# Altium schematic sheet DAC.SchDoc
size 279 x 215 mm; SheetNumber: 2; SheetTotal: 5; SPICEModelCacheRUGZJIPY: <root> / <DocumentId>RUGZJIPY</DocumentId> / <CacheFrame Number="0"> / <Model Name="cap" Kind="MDL"> / <Text>*Default semiconductor capacitor / .MODEL CAP C()</Text> / </Model> / </CacheFrame> / </root>
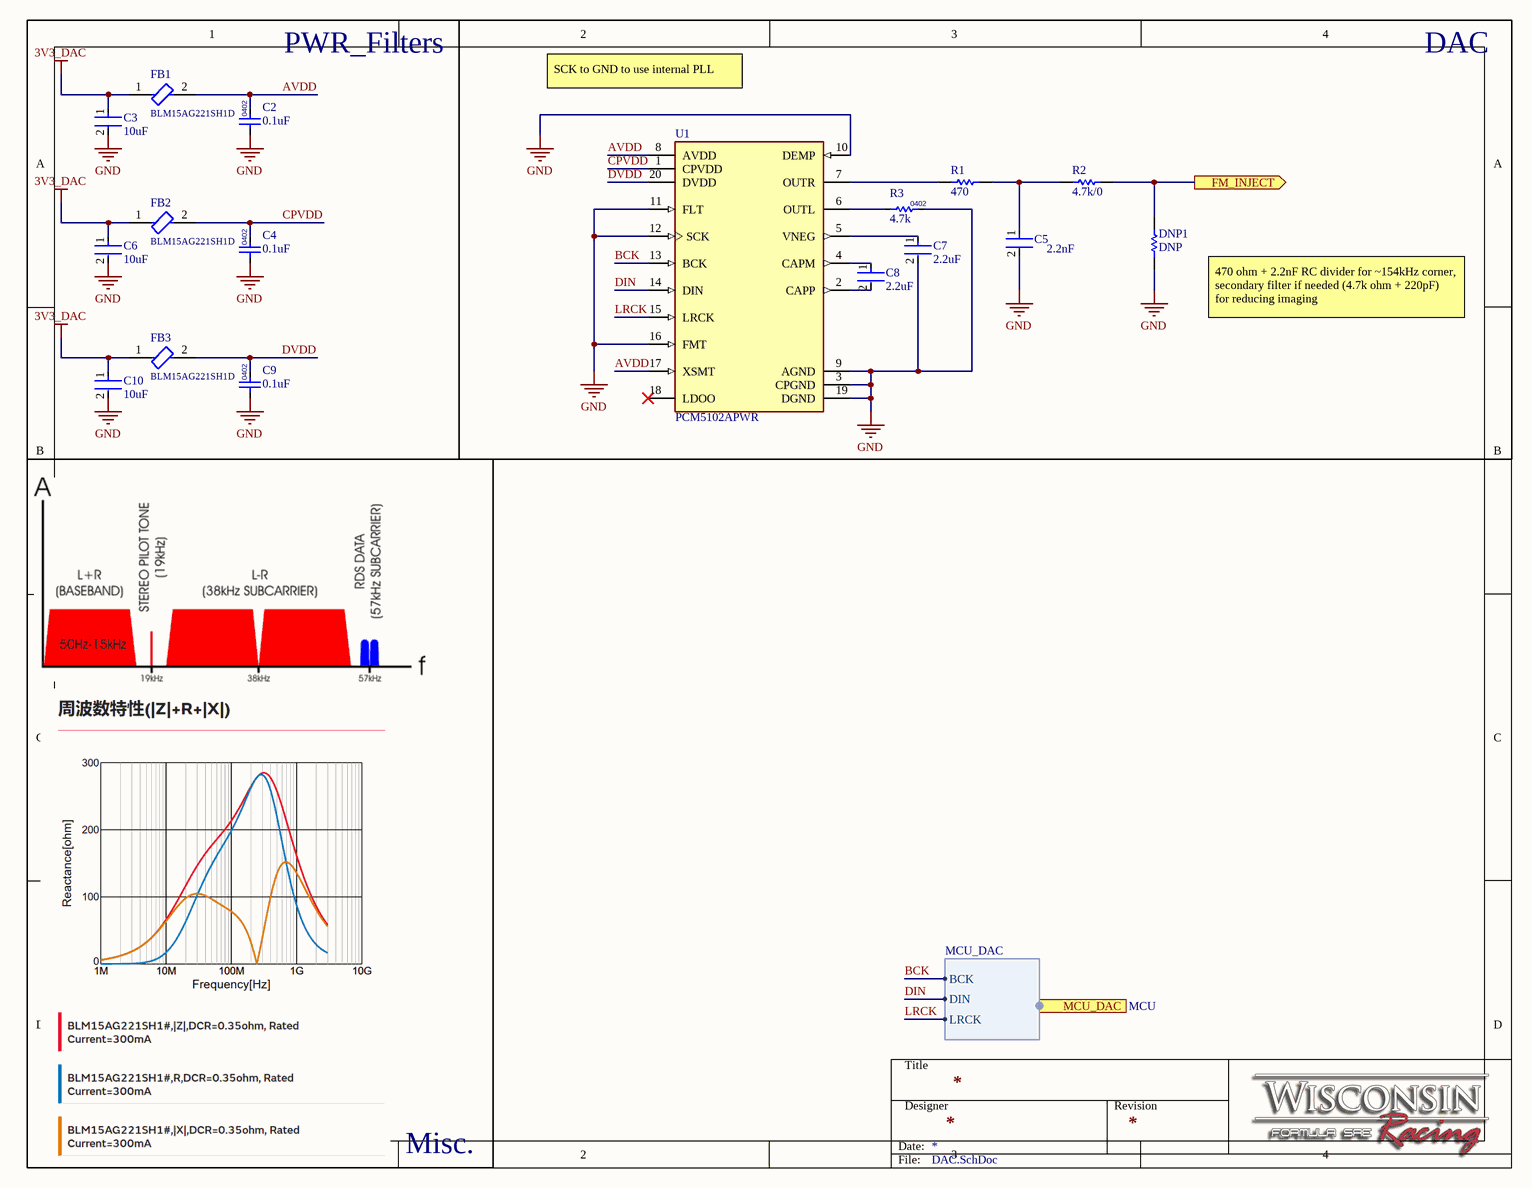
[diagram p0: DAC.SchDoc]

## Parts
C2  0.1uF  [FP-CC0402-IPC_B]
C3  10uF  [FP-GRM155-0_2-IPC_A]
C4  0.1uF  [FP-CC0402-IPC_B]
C5  2.2nF  [FP-GRM155-0_05-IPC_C]
C6  10uF  [FP-GRM155-0_2-IPC_A]
C7  2.2uF  [FP-GRM155-0_2-IPC_B]
C8  2.2uF  [FP-GRM155-0_2-IPC_B]
C9  0.1uF  [FP-CC0402-IPC_B]
C10  10uF  [FP-GRM155-0_2-IPC_A]
DNP1  DNP  [RESC1005X40X25NL05T10]
FB1  BLM15AG221SH1D  [FP-BLM15-0_05-MFG]
FB2  BLM15AG221SH1D  [FP-BLM15-0_05-MFG]
FB3  BLM15AG221SH1D  [FP-BLM15-0_05-MFG]
R1  470  [RESC1005X40X25ML05T10]
R2  4.7k/0  [RESC1005X40X25NL05T10]
R3  value 4.7k  [RESC1005X40X25NL05T10]  (hidden comment: 4.7k 1%)
U1  PCM5102APWR  [FP-PW0020A-IPC_A]

## Blocks framed on the sheet
PWR_Filters: C2-C4 C6 C9 C10 FB1-FB3
DAC: C5 C7 C8 DNP1 R1-R3 U1

## Ports
FM_INJECT (out), MCU_DAC (harness MCU_DAC, see MCU)

## Harnesses
MCU_DAC: BCK, DIN, LRCK

## Nets
3V3_DAC: C3.1 C6.1 C10.1 FB1.1 FB2.1 FB3.1
GND: C2.1 C3.2 C4.1 C5.2 C6.2 C7.2 C9.1 C10.2 DNP1.1 R3.2 U1.3(CPGND) U1.9(AGND) U1.10(DEMP) U1.11(FLT) U1.12(SCK) U1.16(FMT) U1.19(DGND)
AVDD: C2.2 FB1.2 U1.8(AVDD) U1.17(XSMT)
BCK: U1.13(BCK) ; port MCU_DAC.BCK
CPVDD: C4.2 FB2.2 U1.1(CPVDD)
DIN: U1.14(DIN) ; port MCU_DAC.DIN
DVDD: C9.2 FB3.2 U1.20(DVDD)
FM_INJECT: DNP1.2 R2.2 ; port FM_INJECT
LRCK: U1.15(LRCK) ; port MCU_DAC.LRCK
NetC5_1: C5.1 R1.2 R2.1
NetC7_1: C7.1 U1.5(VNEG)
NetC8_1: C8.1 U1.4(CAPM)
NetC8_2: C8.2 U1.2(CAPP)
NetR1_1: R1.1 U1.7(OUTR)
NetR3_1: R3.1 U1.6(OUTL)

Not connected (* = marked no-connect by the designer): U1 18(LDOO)*

## Notes on the sheet
- SCK to GND to use internal PLL
- 470 ohm + 2.2nF RC divider for ~154kHz corner, secondary filter if needed (4.7k ohm + 220pF)  for reducing imaging
- Misc.
- Title
- Designer
- Revision
- Date:
- File:
- (in symbol CMP-Cap-00006-1) 0402

## Library data of the parts
C2 C4 C9 = CMP-Cap-00006-1: Ceramic Capacitor, Multilayer, Ceramic, 16V, 10% +Tol, 10% -Tol, X7R, 15% TC, 0.1uF, Surface Mount, 0402; Dielectric: XR7; Capacitance: 100nF; Tolerance: 10%; Voltage Rating: 16V
C3 C6 C10 = CMP-06035-061139-1: Chip Multilayer Ceramic Capacitors for General Purpose, 0402, 10uF, X5R, 15%, 20%, 6.3V
C5 = CMP-06035-062041-1: Chip Multilayer Ceramic Capacitors for General Purpose, 0402, 2200pF, C0G, 30ppm/°C, 5%, 50V
C7 C8 = CMP-06035-003072-1: Chip Multilayer Ceramic Capacitors for General Purpose, 0402, 2.2uF, X7R, 15%, 10%, 10V; Case/Package: 0402
DNP1 R2 = CMP-1011-00001-2: Manufacturer: Yageo / Phycomp; Part Number: RC0402JR-070RL
FB1-FB3 = CMP-06046-002173-1: Chip Ferrite Bead, 0402, 220Ω @ 100MHz, 0.35Ω, 25%, 300mA; Impedance: 220R; Number of Lines: 1; DC Resistance (DCR): 350mR; Package Quantity: 10000; Max Operating Temperature: 125°C; Case Code (Imperial): 0402; Ratings: AEC-Q200; Packaging: Tape and Reel; Width: 0.5mm; Core Material: Ferrite; Length: 0.039inch; Max Current Rating: 300mA; REACH SVHC: No SVHC; Weight: 2.3E-05oz; Height: 0.022inch; Max DC Current: 300mA; Series: EMIFIL®, BLM15A_SH; Test Frequency: 100MHz; Min Operating Temperature: -55°C; Termination: SMD/SMT; Mount: Surface Mount; Case Code (Metric): 1005; Depth: 0.55mm; Case/Package: 0402; RoHS Compliant: Yes; Tolerance: 25%; Number of Circuits: 1
R1 = CMP-2002-07697-1: Part Number: RC0402FR-07470RL; Manufacturer: Yageo / Phycomp
R3 = CMP-00178-1: Res General Purpose Thick Film 0402 4.7K Ohm 1% 1/16W ±100ppm/°C Molded SMD Paper T/R; Power Rating: 63mW; Voltage Rating (AC): 50V; Power Dissipation: 62.5mW; REACH SVHC: Yes; Harmonized Tariff Schedule (HTS) Code: 8533.21.00.30; Composition: Thick Film; Max Operating Temperature: 155°C; Number of Terminals: 2; Min Operating Temperature: -55°C; Depth: 500µm; Introduction Date: 2008-07-18; Case Code (Metric): 1005; Pins: 2; Packaging: Tape & Reel; Height: 350µm; China RoHS: Non-Compliant; Lead Free: Lead Free; Termination: SMD/SMT; Tolerance: 1%; Schedule B: 8533210045, 8533210045; Length: 1mm; Lifecycle Status: Production; Case Code (Imperial): 0402; RoHS: Compliant; Width: 500µm; Mounting Technology: Surface Mount; Temperature Coefficient: 100ppm/°C; Export Control Classification Number (ECCN) Code: EAR99; Country of Origin: Mainland China, Taiwan; Working Voltage: 50V; Voltage Rating: 50V; Case/Package: 0402; Voltage Rating (DC): 50V; Military Standard: Not
U1 = CMP-04861-000013-1: IC DAC 16/24/32BIT 384K 20TSSOP; Power Consumption: 59.4mW; Number of Analog Inputs: 0; Supply Type: Analog; Resolution: 32b; Number of Analog Outputs: 2; Max Power Dissipation: 187mW; Sampling Rate: 384KS/s; Operating Supply Voltage: 3.3V; Number of Bits: 32; Max Supply Voltage: 3.6V; Interface: Serial; Polarity: Unipolar; Min Supply Voltage: 3V; Output Type: Voltage; Signal to Noise Ratio (SNR): 112dB; Contact Plating: Gold; Package Quantity: 2000; Number of Pins: 20; Max Operating Temperature: 85°C; Series: DirectPath™; Case/Package: TSSOP; Conversion Rate: 384KS/s; Number of DAC Channels: 2; Mount: Surface Mount; REACH SVHC: No SVHC; Packaging: Tape and Reel; Number of Converters: 2; Min Operating Temperature: -25°C; Lead Free: Lead Free